# EAGLE design FanManager (EAGLE 9.2.2)
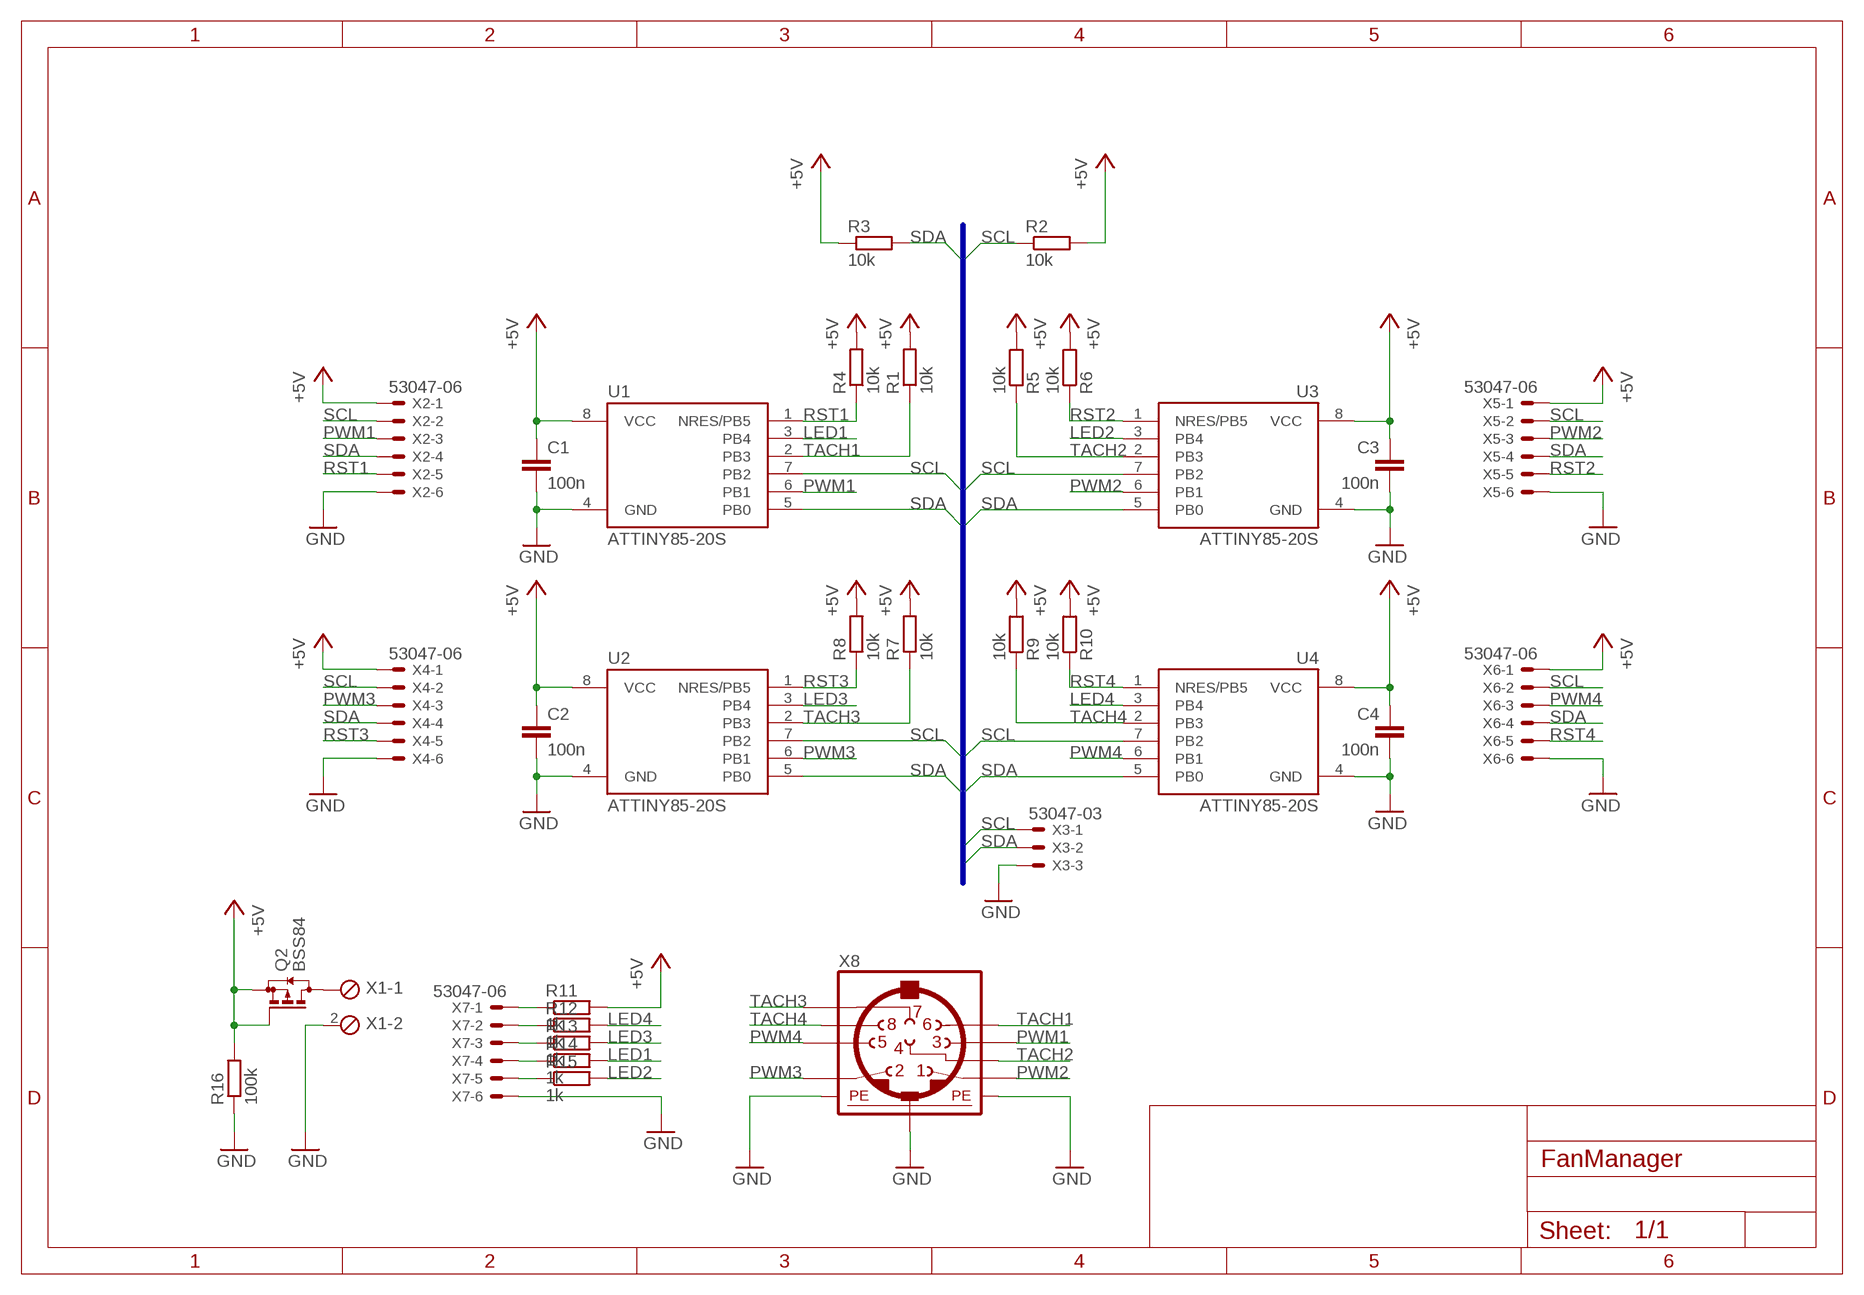
[diagram p0: schematic, sheet 1]

## Parts
C1  100n  C-EUC0805  [C0805]
C2  100n  C-EUC0805  [C0805]
C3  100n  C-EUC0805  [C0805]
C4  100n  C-EUC0805  [C0805]
Q2  BSS84  [SOT23]
R1  10k  R-EU_R0805  [R0805]
R2  10k  R-EU_R0805  [R0805]
R3  10k  R-EU_R0805  [R0805]
R4  10k  R-EU_R0805  [R0805]
R5  10k  R-EU_R0805  [R0805]
R6  10k  R-EU_R0805  [R0805]
R7  10k  R-EU_R0805  [R0805]
R8  10k  R-EU_R0805  [R0805]
R9  10k  R-EU_R0805  [R0805]
R10  10k  R-EU_R0805  [R0805]
R11  1k  R-EU_R0805  [R0805]
R12  1k  R-EU_R0805  [R0805]
R13  1k  R-EU_R0805  [R0805]
R14  1k  R-EU_R0805  [R0805]
R15  1k  R-EU_R0805  [R0805]
R16  100k  R-EU_R0805  [R0805]
U1  ATTINY85-20S  [SOIC8_EIAJ_208MIL]
U2  ATTINY85-20S  [SOIC8_EIAJ_208MIL]
U3  ATTINY85-20S  [SOIC8_EIAJ_208MIL]
U4  ATTINY85-20S  [SOIC8_EIAJ_208MIL]
X1  KLEMME_2XRAND_LANGPAD  [2POL254]
X2  53047-06  [53047-06]
X3  53047-03  [53047-03]
X4  53047-06  [53047-06]
X5  53047-06  [53047-06]
X6  53047-06  [53047-06]
X7  53047-06  [53047-06]
X8  MINI_DIN_8  [M_DIN8]

## Nets
+5V: C1.1 C2.1 C3.1 C4.1 Q2.1(G) Q2.2(S) R1.2 R2.2 R3.1 R4.2 R5.2 R6.2 R7.2 R8.2 R9.2 R10.2 R11.2 R16.2 U1.8(VCC) U2.8(VCC) U3.8(VCC) U4.8(VCC) X2.1 X4.1 X5.1 X6.1
GND: C1.2 C2.2 C3.2 C4.2 R16.1 U1.4(GND) U2.4(GND) U3.4(GND) U4.4(GND) X1.2 X2.6 X3.3 X4.6 X5.6 X6.6 X7.6 X8.SH1(PE1) X8.SH2(PE2) X8.SH3(PE3)
LED1: R14.2 U1.3(PB4)
LED2: R15.2 U3.3(PB4)
LED3: R13.2 U2.3(PB4)
LED4: R12.2 U4.3(PB4)
N$1: Q2.3(D) X1.1
N$2: R11.1 X7.1
N$3: R12.1 X7.2
N$4: R13.1 X7.3
N$5: R14.1 X7.4
N$6: R15.1 X7.5
PWM1: U1.6(PB1) X2.3 X8.3
PWM2: U3.6(PB1) X5.3 X8.1
PWM3: U2.6(PB1) X4.3 X8.2
PWM4: U4.6(PB1) X6.3 X8.5
RST1: R4.1 U1.1(NRES/PB5) X2.5
RST2: R6.1 U3.1(NRES/PB5) X5.5
RST3: R8.1 U2.1(NRES/PB5) X4.5
RST4: R10.1 U4.1(NRES/PB5) X6.5
SCL: R2.1 U1.7(PB2) U2.7(PB2) U3.7(PB2) U4.7(PB2) X2.2 X3.1 X4.2 X5.2 X6.2
SDA: R3.2 U1.5(PB0) U2.5(PB0) U3.5(PB0) U4.5(PB0) X2.4 X3.2 X4.4 X5.4 X6.4
TACH1: R1.1 U1.2(PB3) X8.6
TACH2: R5.1 U3.2(PB3) X8.4
TACH3: R7.1 U2.2(PB3) X8.7
TACH4: R9.1 U4.2(PB3) X8.8

## Buses
I2C,SCL,SDA

## Library data of the parts
C1-C4 = 1a BK_Hennef:C-EU: CAPACITOR, European symbol
Q2 = transistor-small-signal:BSS84: P-CHANNEL MOS FET
R1-R16 = 1a BK_Hennef:R-EU_: RESISTOR, European symbol
U1-U4 = attiny:ATTINY85*: ATMEL ATtiny 85 Packages: P = PDIP 08 30mil S = SOIC 08 EIAJ 208mil Technologies Note: for complete ordering code (temp. range, finish, tape&reel etc.) see www.atmel.com • Supply Voltage: V = (1.8…5.5)V | [blank] = (2.7…5.5)V • Speed: 10 = 10 MHz | 20 = 20 MHz Author: Dipl.-Ing. FH Rainer Bayer HHN Hochschule Heilbronn (Heilbronn University), rainer.bayer@hs-heilbronn.de Ingenieurbüro ing-rb, mail@ing-rb.de
X1 = 1a BK_Hennef:KLEMME_2X: PHOENIX CONNECTOR
X2 X4-X7 = con-molex:53?-06: CONNECTOR wire to board 1.25 mm (.049 inch) pitch header; MF: MOLEX; MPN: 53047-0610-C; OC_FARNELL: 9733078; OC_NEWARK: 03M2965
X3 = con-molex:53?-03: CONNECTOR wire to board 1.25 mm (.049 inch) pitch header; MF: MOLEX; MPN: 530470310; OC_FARNELL: 9732853; OC_NEWARK: 14R5412
X8 = mini_din:MINI_DIN_8

## Board
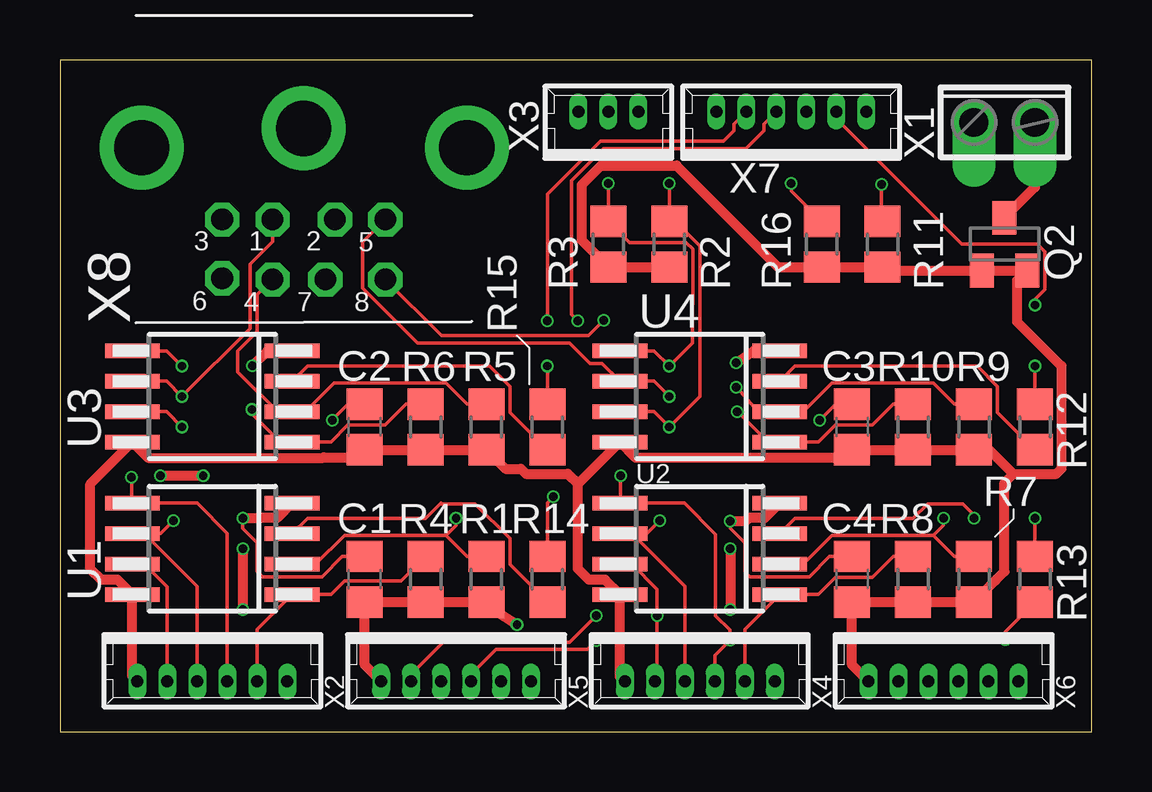
[diagram p1: board, top side]
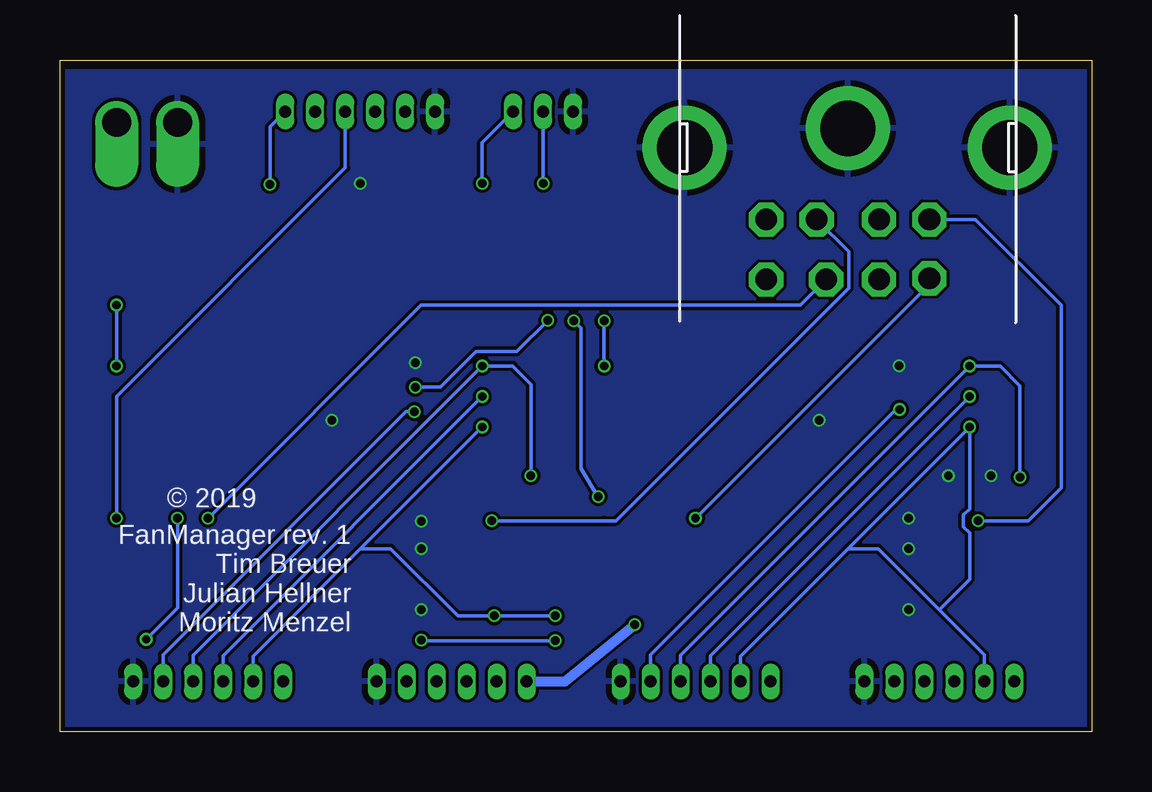
[diagram p2: board, bottom side, seen from below]

Size 43 x 28 mm. Coordinates in mm from the lower left corner, seen from the top.
Outline: 0,0 43,0 43,28 0,28 0,0
Copper layers (1*16): Top 0.035mm / dielectric 1.6mm / Bottom 0.035mm
Design rules "jlcpcb": minimum track width 5mil, minimum drill 0.3mm, track to track 5mil, track to pad 5mil, pad to pad 5mil, via to via 5mil, smd to smd 5mil, copper to edge 0.2mm, drill to drill 6mil, minimum pad ring 3mil, minimum via ring 3mil, stop-mask expansion 4mil, vias tented up to drill 0mil, thermal gap 10mil

### Footprints (pad centres in the part's own frame; a part is rotated, then mirrored left to right if it is on the bottom)
C0805 = smd 1.3 x 1.5: 1 -0.95,0; 2 0.95,0
SOT23 = smd 1 x 1.4: 1 -0.95,-1.1; 2 0.95,-1.1; 3 0,1.1
R0805 = smd 1.3 x 1.5: 1 -0.95,0; 2 0.95,0
SOIC8_EIAJ_208MIL = smd 0.6 x 2.286: 1 -1.905,-3.33; 2 -0.635,-3.33; 3 0.635,-3.33; 4 1.905,-3.33; 5 1.905,3.33; 6 0.635,3.33; 7 -0.635,3.33; 8 -1.905,3.33
2POL254 = drill 1.2 offset: 1 1.27,0; 2 -1.27,0
53047-06 = drill 0.5 pad 0.698 long: 1 3.125,0.45; 2 1.875,0.45; 3 0.625,0.45; 4 -0.625,0.45; 5 -1.875,0.45; 6 -3.125,0.45
53047-03 = drill 0.5 pad 0.698 long: 1 1.25,0.45; 2 0,0.45; 3 -1.25,0.45
M_DIN8 = drill 0.9 pad 1.422 octagon: 1 -1.3,-3.8; 2 1.3,-3.8; 3 -3.4,-3.8; 4 -1.3,-6.3; 5 3.4,-3.8; 6 -3.4,-6.25; 7 0.9,-6.3; 8 3.4,-6.3 | drill 2.3 pad 3.5: SH1 6.8,-0.8; SH2 0,0; SH3 -6.75,-0.8

### Placement (x,y rotation side)
C1  12.7,6.35 90 top
C2  12.7,12.7 90 top
C3  33.02,12.7 90 top
C4  33.02,6.35 90 top
Q2  39.37,20.32 0 top
R1  17.78,6.35 270 top
R2  25.4,20.32 270 top
R3  22.86,20.32 90 top
R4  15.24,6.35 270 top
R5  17.78,12.7 270 top
R6  15.24,12.7 270 top
R7  38.1,6.35 270 top
R8  35.56,6.35 270 top
R9  38.1,12.7 270 top
R10  35.56,12.7 270 top
R11  34.29,20.32 270 top
R12  40.64,12.7 270 top
R13  40.64,6.35 270 top
R14  20.32,6.35 270 top
R15  20.32,12.7 270 top
R16  31.75,20.32 270 top
U1  6.35,7.62 90 top
U2  26.67,7.62 90 top
U3  6.35,13.97 90 top
U4  26.67,13.97 90 top
X1  39.37,25.4 0 top
X2  6.35,2.54 180 top
X3  22.86,25.4 0 top
X4  26.67,2.54 180 top
X5  16.51,2.54 180 top
X6  36.83,2.54 180 top
X7  30.48,25.4 0 top
X8  10.16,25.15 0 top

### Tracks (layer width: path | path; a pad name or v marks a point on that pad's centre or on a via)
+5V  (via drill 0.35)
  Top 0.406: X2.1 3.02,2.29 U1.8 2.41,6.33 1.73,6.33 1.27,6.79 1.27,10.31 U3.8 3.68,11.41 10.97,11.41 10.99,11.43 12.38,11.43 C2.1 R6.2 R5.2 18.57,10.96 19.21,10.96 19.42,10.74 21.16,10.74 21.59,10.31 | X5.1 12.7,2.77 C1.1 R4.2 R1.2 18.16,5.03 v19.05,4.46 | X4.1 23.34,2.29 U2.8 22.73,6.33 22.05,6.33 21.59,6.79 21.59,10.31 | X6.1 33.02,2.77 C4.1 R8.2 R7.2 38.99,6.29 39,6.29 39.37,6.67 39.37,10.37 39.74,10.74 | 21.59,10.31 U4.8 24,11.41 32.68,11.41 C3.1 R10.2 R9.2 38.74,11.75 39.74,10.74 | 39.74,10.74 41.54,10.74 41.75,10.95 41.75,15.24 39.91,17.08 39.91,18.81 Q2.2 Q2.1 34.44,19.22 R11.2 R16.2 29.93,19.37 25.7,23.59 22.56,23.59 21.75,22.79 21.75,20.47 21.96,20.26 21.97,20.26 R3.1 R2.2
  Bottom 0.406: X4.1 21.94,2.09 v19.05,4.46
GND  (via drill 0.35)
  Top 0.152: C1.2 11.76,7.3 10.92,6.46 8.44,6.46 8.23,6.67 8.23,7.87 7.62,8.48 v7.62,8.89 | C4.2 32.08,7.3 31.24,6.46 28.76,6.46 28.55,6.67 28.55,7.87 27.95,8.47 v27.95,8.76 | v11.35,12.98 12.02,13.65 C2.2 | C3.2 32.34,13.65 v31.67,12.98 | R16.1 30.48,22.54 v30.48,22.86
  Top 0.406: v8.02,15.24 8.65,15.88 U3.4 | v28.19,15.37 28.91,15.88 U4.4 | v27.94,7.62 v27.94,5.08 | v7.62,7.62 v7.62,5.08 | v4.19,10.67 v5.97,10.67 | U1.4 9.07,8.91 8.39,8.91 8.37,8.89 v7.62,8.89 | U2.4 29.39,8.91 28.71,8.91 28.56,8.76 v27.95,8.76
  pour Bottom: 0,0 0,27.56 43.18,27.56 43.18,0
LED1
  Top 0.152: R14.2 18.76,6.96 18.76,7.62 | 18.76,7.62 18.76,8.04 17.31,9.5 15.9,9.5 15.88,9.53 15.24,8.89 10.31,8.89 U1.3 | 18.76,7.62
LED2
  Top 0.152: U3.3 10.31,15.24 17.91,15.24 18.76,14.39 18.76,13.97 18.76,13.31 R15.2
LED3  (via drill 0.35)
  Top 0.152: U2.3 30.64,8.89 35.56,8.89 36.17,9.5 37.63,9.5 38.1,9.02 v38.1,8.89 | R13.2 39.41,4.17 v39.41,3.85
  Bottom 0.152: v39.41,3.85 38.1,5.15 v38.1,8.89
LED4
  Top 0.152: U4.3 30.64,15.24 38.1,15.24 38.23,15.24 39.08,14.39 39.08,13.97 39.08,13.31 R12.2
N$1
  Top 0.406: X1.1 40.64,22.69 Q2.3
N$2  (via drill 0.35)
  Top 0.152: R11.1 34.24,21.32 v34.24,22.81
  Bottom 0.152: v34.24,22.81 34.24,25.21 X7.1
N$3  (via drill 0.35)
  Top 0.152: X7.2 32.35,25.56 37.59,20.32 40.74,20.32 41.05,20.02 41.05,18.43 40.64,18.02 v40.64,17.78 | R12.1 v40.64,15.24
  Bottom 0.152: v40.64,17.78 v40.64,15.24
N$4  (via drill 0.35)
  Top 0.152: v40.64,8.89 R13.1
  Bottom 0.152: v40.64,8.89 40.64,13.97 31.11,23.5 X7.3
N$5  (via drill 0.35)
  Top 0.152: R14.1 20.32,9.54 v20.57,9.79 | v21.59,17.12 21.32,17.38 21.32,22.97 22.66,24.31 28.6,24.31 29.34,25.04 29.34,25.33 X7.4
  Bottom 0.152: v21.59,17.12 21.29,16.81 21.29,10.96 v20.57,9.79
N$6  (via drill 0.35)
  Top 0.152: v20.32,15.24 R15.1 | X7.5 28.09,25.33 28.09,25.04 27.66,24.61 22.53,24.61 20.32,22.4 v20.32,17.12
  Bottom 0.152: v20.32,17.12 v20.32,15.24
PWM1  (via drill 0.35)
  Top 0.152: X2.3 5.72,6.05 3.52,8.26 U1.6 4.2,8.26 v4.73,8.79
  Bottom 0.152: v4.73,8.79 2.65,8.79 1.27,10.16 1.27,17.78 4.84,21.35 X8.3
PWM2  (via drill 0.35)
  Top 0.152: U3.6 4.45,14.61 v5.08,13.97 7.92,16.81 7.92,19.49 8.86,20.43 X8.1
  Bottom 0.152: v5.08,13.97 15.88,3.17 X5.3
PWM3  (via drill 0.35)
  Top 0.152: X4.3 26.05,6.05 23.84,8.26 U2.6 24.46,8.26 v25,8.79
  Bottom 0.152: v25,8.79 20.32,8.79 19.83,8.79 10.12,18.49 10.12,20.01 X8.2
PWM4  (via drill 0.35)
  Top 0.152: v25.4,13.97 24.77,14.61 U4.6 22.6,15.35 22.1,15.35 21.24,16.2 14.91,16.2 12.62,18.49 12.62,20.41 X8.5
  Bottom 0.152: v25.4,13.97 36.2,3.17 X6.3
RST1
  Top 0.152: X2.5 8.22,4.26 U1.1 11.29,5.71 11.86,6.28 14.22,6.28 R4.1
RST2  (via drill 0.35)
  Top 0.152: R6.1 14.42,13.65 13.54,12.77 12,12.77 11.29,12.06 U3.1 9.18,12.06 8.01,13.24 v8.01,13.43
  Bottom 0.152: X5.5 18.39,3.21 8.16,13.43 v8.01,13.43
RST3
  Top 0.152: X4.5 28.55,4.26 U2.1 31.61,5.71 32.32,6.42 33.87,6.42 34.74,7.3 R8.1
RST4  (via drill 0.35)
  Top 0.152: R10.1 34.74,13.65 33.87,12.77 32.32,12.77 31.61,12.06 U4.1 29.5,12.06 v28.23,13.34
  Bottom 0.152: X6.5 38.7,3.21 28.57,13.34 v28.23,13.34
SCL  (via drill 0.35)
  Top 0.152: X2.2 4.47,6.03 3.52,6.99 U1.7 | U3.7 4.45,13.34 v5.08,12.7 | U4.7 24.77,13.34 v25.4,12.7 26.67,13.97 26.67,17.69 26.68,17.7 26.68,20.24 25.65,21.27 R2.1 v25.4,22.86 | X5.2 14.63,2.38 15.98,3.72 21.25,3.72 v22.35,4.83 | U2.7 23.84,6.99 24.89,5.93 v24.89,4.83 24.89,2.19 X4.2
  Bottom 0.152: 10.16,7.62 v5.08,12.7 5.08,9.29 5.33,9.04 5.33,8.53 5.08,8.28 5.08,6.35 6.35,5.08 | 10.16,7.62 14.63,3.15 X5.2 | v25.4,12.7 30.48,7.62 | 30.48,7.62 34.95,3.15 X6.2 | X2.2 4.47,3.21 6.35,5.08 | 10.16,7.62 8.89,7.62 6.35,5.08 | 30.48,7.62 29.21,7.62 26.42,4.83 v24.89,4.83 v22.35,4.83 | v25.4,22.86 25.4,24.56 X3.1
SDA  (via drill 0.35)
  Top 0.152: U3.5 4.45,15.88 v5.08,15.24 | U4.5 24.77,15.88 v25.4,15.24 26.36,16.2 26.36,17.82 26.38,17.83 26.38,20.11 26.1,20.39 23.74,20.39 R3.2 v22.86,22.86 | v2.98,10.61 2.98,9.56 U1.5 5.71,9.53 6.97,8.27 X2.4 | v23.37,10.67 23.37,9.55 U2.5 26.04,9.53 27.33,8.23 27.33,4.83 27.93,4.23 v27.93,3.81 27.3,3.17 X4.4 | X5.4 17.14,2.38 18.17,3.42 21.98,3.42 v22.35,3.79
  Bottom 0.152: X5.4 17.14,3.19 v5.08,15.24 3.81,15.24 2.98,14.41 v2.98,10.61 | X6.4 37.45,3.19 v25.4,15.24 24.13,15.24 23.37,14.48 v23.37,10.67 | v22.86,22.86 X3.2 | v27.93,3.81 27.91,3.79 v22.35,3.79
TACH1  (via drill 0.35)
  Top 0.152: R1.1 16.96,7.3 16.09,8.18 | 16.09,8.18 11.86,8.18 10.66,6.99 U1.2 | 16.09,8.18 16.51,8.6 v16.51,8.89
  Bottom 0.152: v16.51,8.89 6.76,18.64 X8.6
TACH2
  Top 0.152: R5.1 16.96,13.65 16.09,14.53 11.43,14.53 10.24,13.34 U3.2 9.07,13.34 7.41,14.99 7.41,15.87 7.84,16.29 8.22,16.68 8.22,18.21 X8.4
TACH3  (via drill 0.35)
  Top 0.152: R7.1 37.28,7.3 36.41,8.18 | 36.41,8.18 32.17,8.18 30.98,6.99 U2.2 | 36.41,8.18 36.83,8.6 v36.83,8.89
  Bottom 0.152: v36.83,8.89 27.94,17.78 12.13,17.78 X8.7
TACH4  (via drill 0.35)
  Top 0.152: R9.1 37.28,13.65 36.41,14.53 32.17,14.53 30.98,13.34 U4.2 29.09,13.34 v28.19,14.36 | X8.8 15.9,16.51 22.03,16.51 v22.66,17.14
  Bottom 0.152: v28.19,14.36 27.14,14.36 25.65,15.85 23.96,15.85 v22.66,17.14

### Text on the board
bNames: © 2019 | FanManager rev. 1 / Tim Breuer / Julian Hellner / Moritz Menzel